# EasyEDA Pro project 云台分线板.eprj

# Schematic Schematic1
Board Name: Board1; Create Date: 2026-02-23; Page Name: P1; Project Name: 云台分线板; Schematic Name: Schematic1; Update Date: 2026-02-23; Company: 嘉立创EDA; Page Size: A4; Version: V1.0
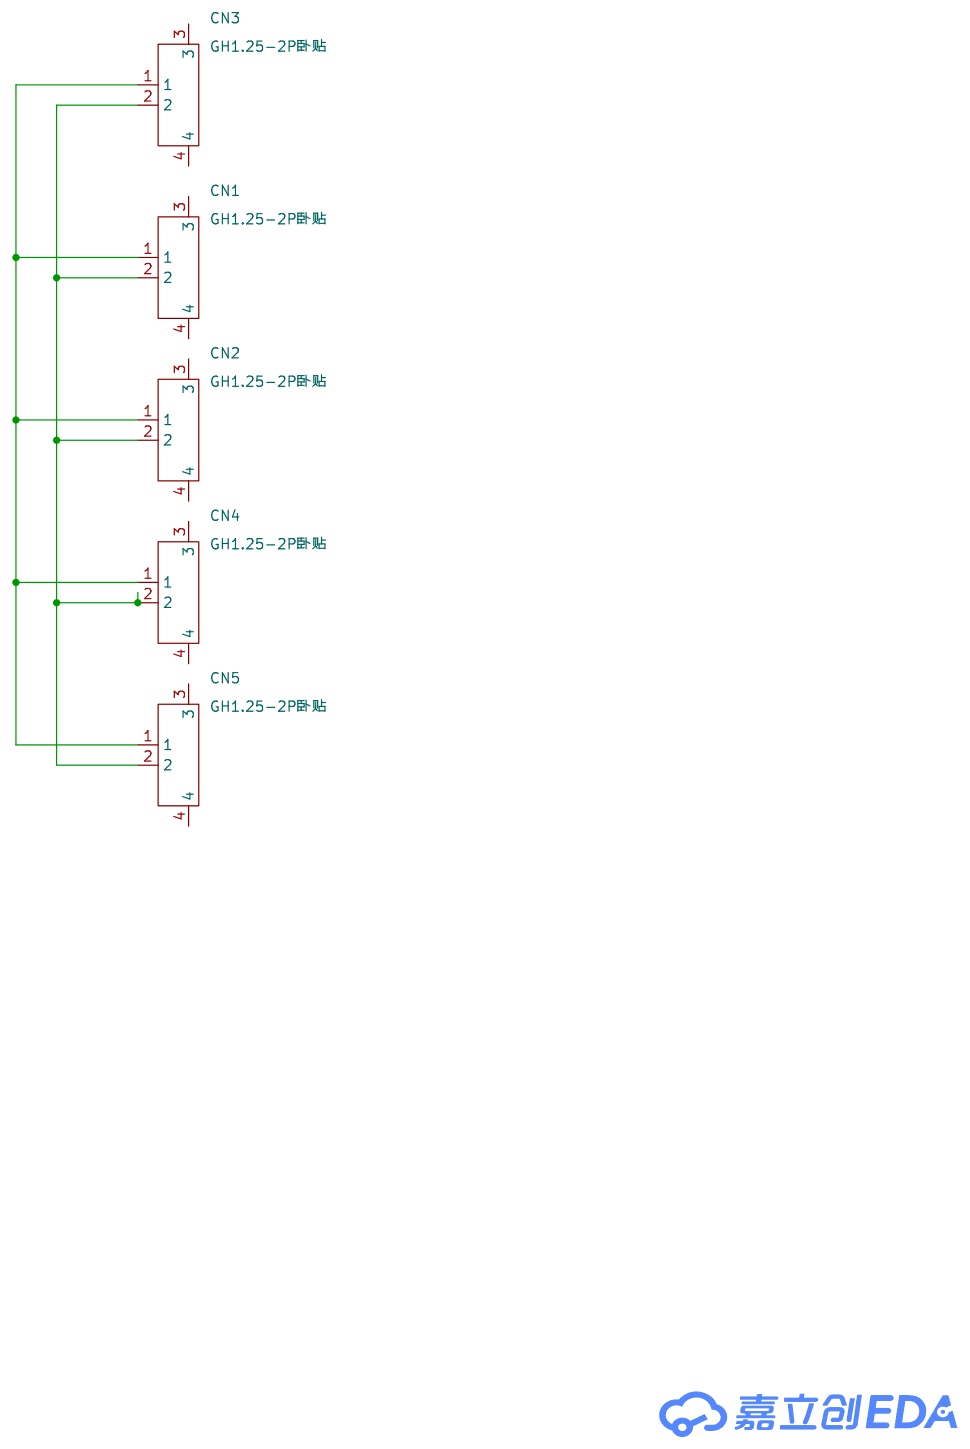
[diagram p0: schematic sheet]

## Parts
CN1  GH1.25-2P卧贴  [CONN-SMD_2P-P1.25_X1251WRS-02HF-LPSW]
CN2  GH1.25-2P卧贴  [CONN-SMD_2P-P1.25_X1251WRS-02HF-LPSW]
CN3  GH1.25-2P卧贴  [CONN-SMD_2P-P1.25_X1251WRS-02HF-LPSW]
CN4  GH1.25-2P卧贴  [CONN-SMD_2P-P1.25_X1251WRS-02HF-LPSW]
CN5  GH1.25-2P卧贴  [CONN-SMD_2P-P1.25_X1251WRS-02HF-LPSW]

## Library data of the parts
CN1-CN5 = GH1.25-2P卧贴_C9900015099: Supplier Part: C9900015099; JLCPCB Part Class: 扩展库; Supplier: LCSC

## Nets
$1N296: CN1.1 CN2.1 CN3.1 CN4.1 CN5.1
$1N349: CN1.2 CN2.2 CN3.2 CN4.2 CN5.2

Not connected (* = marked no-connect by the designer): CN1 3 4; CN2 3 4; CN3 3 4; CN4 3 4; CN5 3 4

# Board PCB1
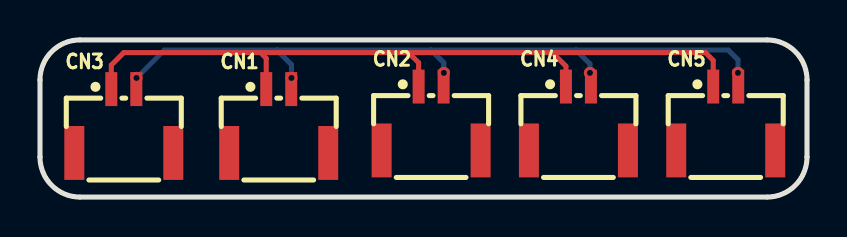
[diagram p1: board, top side]
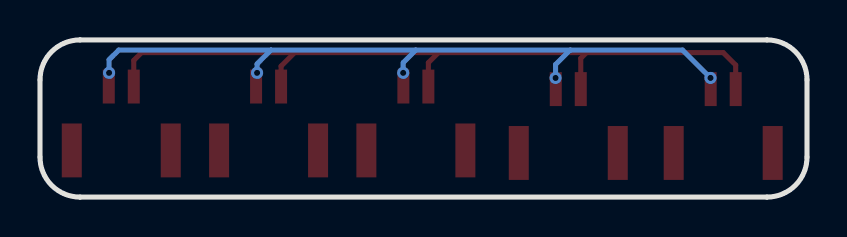
[diagram p2: board, bottom side, seen from below]

Outline 38.35 x 7.87 mm; copper layers: Top Layer, Bottom Layer. Coordinates in mm from the lower left corner of the outline.
Outline path: 0,5.87 0,2 arc(0.59,0.59) 2,0 36.35,0 arc(37.77,0.59) 38.35,2 38.35,5.87 arc(37.77,7.29) 36.35,7.87 2,7.87 arc(0.59,7.29) 0,5.87
Stack: Top Layer 0.035mm / Dielectric1 1.51mm FR4 er 4.5 / Bottom Layer 0.035mm

## Design rules (mm)
template: JLCPCB Capability(Two Layers Board)
spacing copperThickness1oz (default): track to track 0.102, other pairs 0.152 to 0.3
spacing copperThickness2oz: track to track 0.203, other pairs 0.152 to 0.3
track width copperThickness1oz (default): min 0.127, default 0.254, max 2.54
track width copperThickness2oz: min 0.203, default 0.254, max 2.54
differential pair differentialPair (default): width min 0.127, default 0.254, max 2.54; gap min 0.152, default 0.152
via viaSize (default): diameter min 0.5, default 0.61, max 10; hole min 0.3, default 0.305, max 6.3

## Placement (name value [footprint] x y rotation side)
CN1  GH1.25-2P卧贴  [CONN-SMD_2P-P1.25_X1251WRS-02HF-LPSW]  11.94 3.81 0 top
CN2  GH1.25-2P卧贴  [CONN-SMD_2P-P1.25_X1251WRS-02HF-LPSW]  19.56 3.94 0 top
CN3  GH1.25-2P卧贴  [CONN-SMD_2P-P1.25_X1251WRS-02HF-LPSW]  4.19 3.81 0 top
CN4  GH1.25-2P卧贴  [CONN-SMD_2P-P1.25_X1251WRS-02HF-LPSW]  26.92 3.94 0 top
CN5  GH1.25-2P卧贴  [CONN-SMD_2P-P1.25_X1251WRS-02HF-LPSW]  34.29 3.94 0 top

## Footprints (pads in the part's own frame, mm; a bottom-side part is the same pattern mirrored in y, then rotated)
CONN-SMD_2P-P1.25_X1251WRS-02HF-LPSW
  rect 0.6x1.7 smd: 1(-0.625,1.6) 2(0.625,1.6)
  rect 1x2.7 smd: 3(2.475,-1.6) 4(-2.475,-1.6)

## Nets
As in the schematic.

Pads without a net: CN1 3 4; CN2 3 4; CN3 3 4; CN4 3 4; CN5 3 4

## Via types
v1: diameter 0.61, hole 0.305, Top Layer to Bottom Layer, 5 vias

## Routing (per net, layer and track width the routed paths; a pad name or vN(x,y) marks a point on that pad's centre or on a via; arc(x,y) is an arc through that point)
$1N296: length 38.9
  Top Layer w0.254: CN2.1 18.93,6.73 18.43,7.24 ; 11.03,7.24 4.19,7.24 3.57,6.61 CN3.1 ; 11.03,7.24 11.31,6.95 CN1.1 ; 11.03,7.24 18.43,7.24 ; 25.62,7.24 26.3,6.56 CN4.1 ; 25.62,7.24 33.27,7.24 33.67,6.85 CN5.1 ; 25.62,7.24 18.43,7.24
$1N349: length 36
  Bottom Layer w0.254: 19.56,7.37 26.8,7.37 ; 19.56,7.37 11.85,7.37 ; 19.56,7.37 20.19,6.73 v1(20.19,6.22) ; 26.8,7.37 27.5,6.67 v1(27.5,6.22) ; 26.8,7.37 34.42,7.37 34.9,6.88 v1(34.9,6.22) ; 11.85,7.37 6.22,7.37 v1(4.83,5.97) ; 11.85,7.37 12.57,6.64 v1(12.57,5.97)
